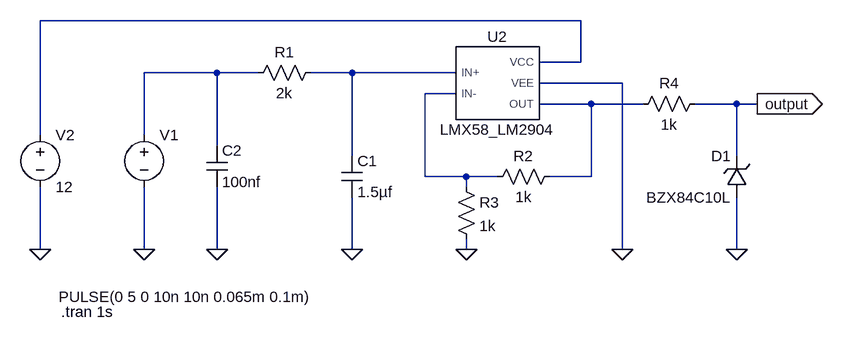
[diagram p0: schematic pmw_to_dc_to_2x.asc]
pmw_to_dc_to_2x.asc, the LTspice schematic file:
Version 4.1
SHEET 1 936 680
WIRE 464 -48 -368 -48
WIRE 464 16 464 -48
WIRE 464 16 400 16
WIRE -96 32 -208 32
WIRE -32 32 -96 32
WIRE 112 32 48 32
WIRE 272 32 112 32
WIRE 528 48 400 48
WIRE 272 64 224 64
WIRE 480 80 400 80
WIRE 560 80 480 80
WIRE 704 80 640 80
WIRE 736 80 704 80
WIRE -368 128 -368 -48
WIRE -208 128 -208 32
WIRE -96 144 -96 32
WIRE 112 160 112 32
WIRE 704 160 704 80
WIRE 224 192 224 64
WIRE 288 192 224 192
WIRE 336 192 288 192
WIRE 480 192 480 80
WIRE 480 192 416 192
WIRE 288 208 288 192
WIRE -368 304 -368 208
WIRE -208 304 -208 208
WIRE -96 304 -96 208
WIRE 112 304 112 224
WIRE 288 304 288 288
WIRE 528 304 528 48
WIRE 704 304 704 224
FLAG -208 304 0
FLAG 112 304 0
FLAG 736 80 output
IOPIN 736 80 Out
FLAG 288 304 0
FLAG -368 304 0
FLAG 528 304 0
FLAG -96 304 0
FLAG 704 304 0
SYMBOL voltage -208 112 R0
WINDOW 3 -132 265 Left 2
WINDOW 123 0 0 Left 0
WINDOW 39 0 0 Left 0
SYMATTR Value PULSE(0 5 0 10n 10n 0.065m 0.1m)
SYMATTR InstName V1
SYMBOL res 64 16 R90
WINDOW 0 0 56 VBottom 2
WINDOW 3 32 56 VTop 2
SYMATTR InstName R1
SYMATTR Value 2k
SYMBOL cap 96 160 R0
SYMATTR InstName C1
SYMATTR Value 1.5µf
SYMBOL voltage -368 112 R0
WINDOW 123 0 0 Left 0
WINDOW 39 0 0 Left 0
SYMATTR InstName V2
SYMATTR Value 12
SYMBOL res 432 176 R90
WINDOW 0 0 56 VBottom 2
WINDOW 3 32 56 VTop 2
SYMATTR InstName R2
SYMATTR Value 1k
SYMBOL res 272 192 R0
SYMATTR InstName R3
SYMATTR Value 1k
SYMBOL cap -112 144 R0
SYMATTR InstName C2
SYMATTR Value 100nf
SYMBOL res 656 64 R90
WINDOW 0 0 56 VBottom 2
WINDOW 3 32 56 VTop 2
SYMATTR InstName R4
SYMATTR Value 1k
SYMBOL zener 720 224 R180
WINDOW 0 24 64 Left 2
WINDOW 3 24 0 Left 2
SYMATTR InstName D1
SYMATTR Value BZX84C10L
SYMBOL LMx58\\LMX58_LM2904 336 48 R0
SYMATTR InstName U2
TEXT -336 400 Left 2 !.tran 1s

The netlist it stands for:
* pmw_to_dc_to_2x.asc
V1 N002 0 PULSE(0 5 0 10n 10n 0.065m 0.1m)
R1 N003 N002 2k
C1 N003 0 1.5µf
V2 N001 0 12
R2 N005 N004 1k
R3 N004 0 1k
C2 N002 0 100nf
R4 output N005 1k
D1 0 output BZX84C10L
X§U2 N003 N004 N001 0 N005 LMX58_LM2904  ; pins IN+ IN- VCC VEE OUT
.model D D
.lib standard.dio
.tran 1s
.lib C:\Users\WBowl\Documents\Work\client_projects\dyno-boards\dyno-side\simulation_validation\LMx58\lmx58_lm2904.lib
.backanno
.end